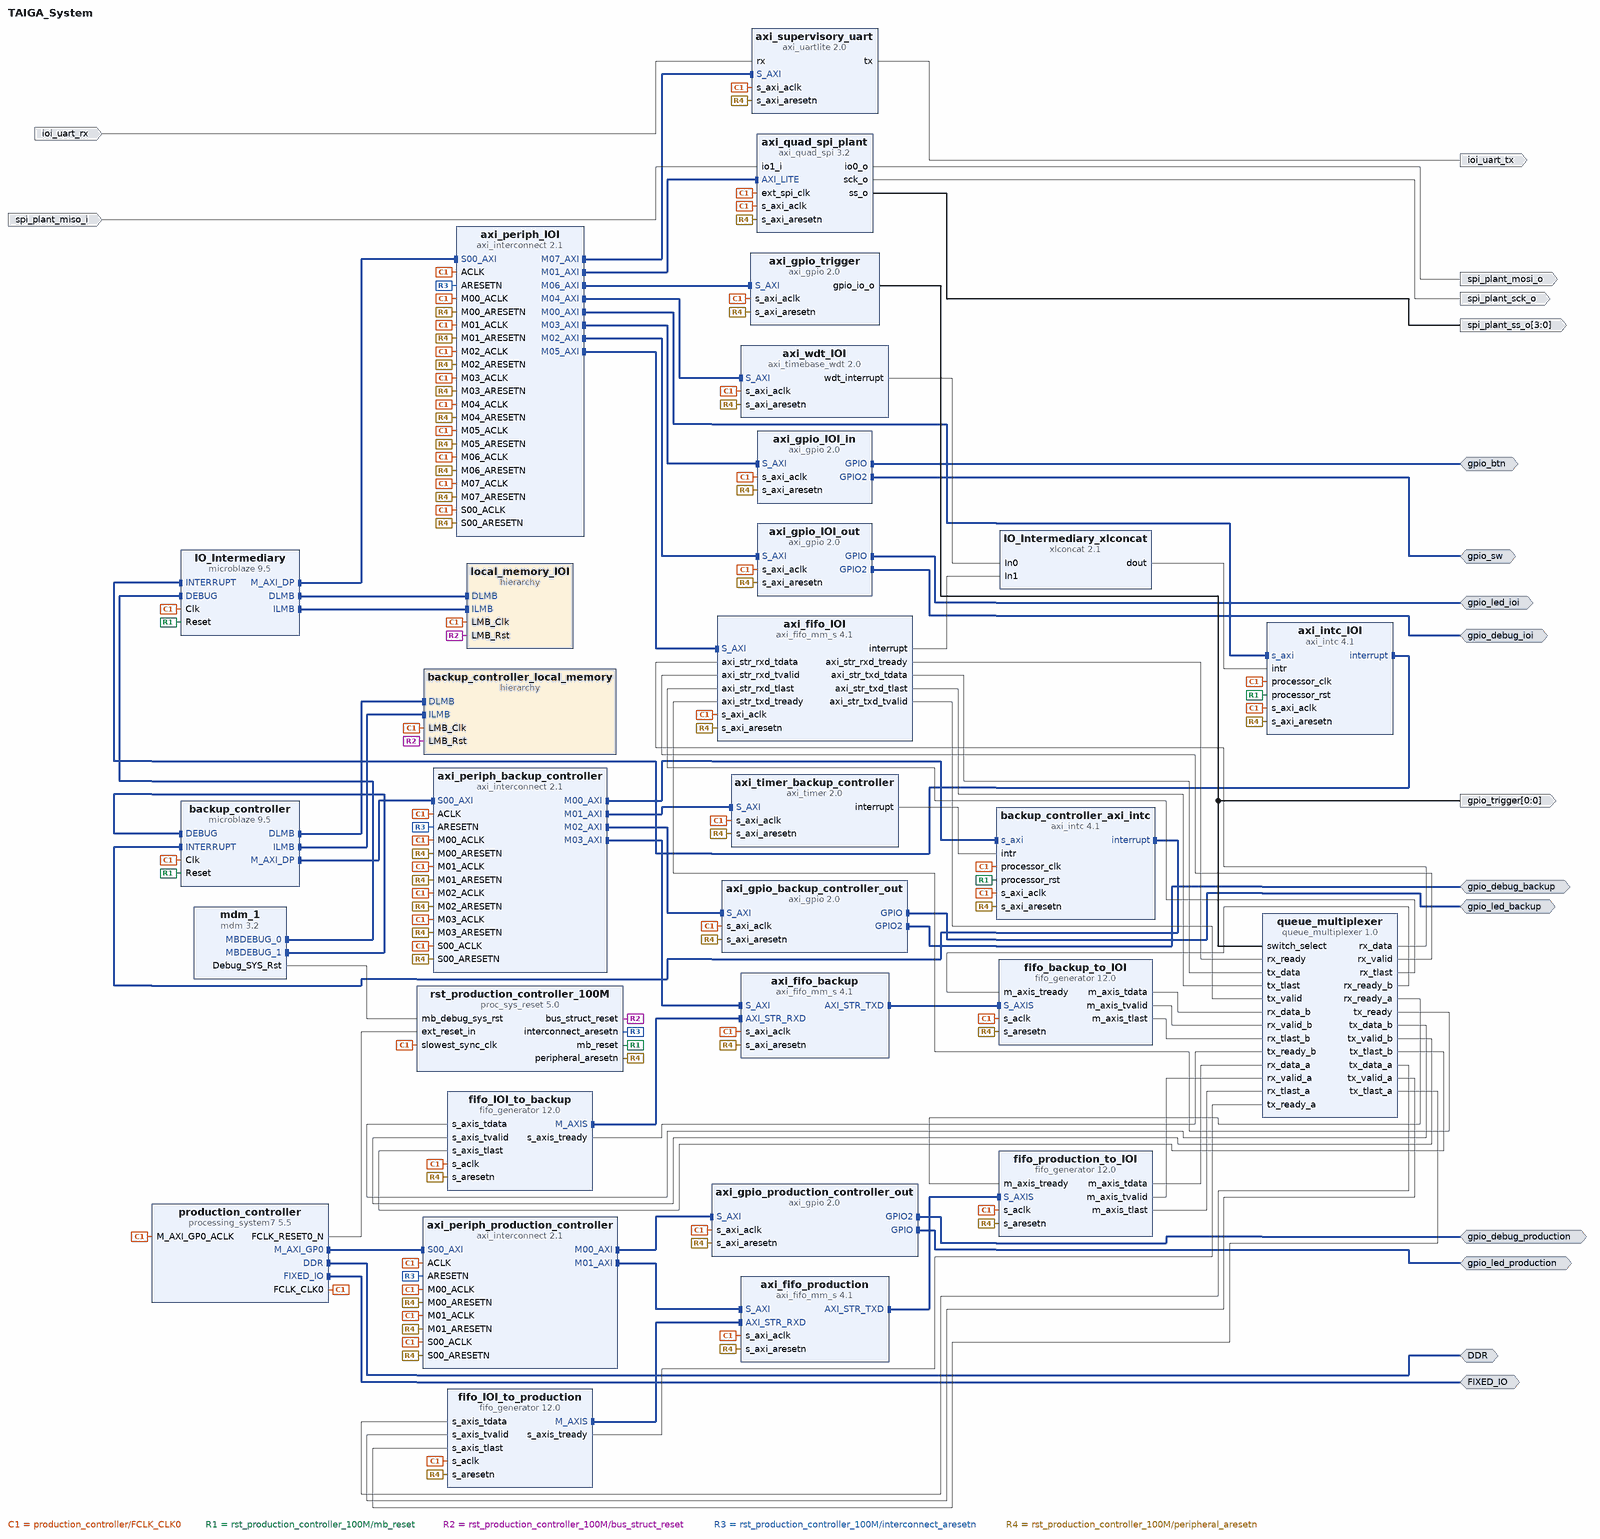
[diagram p0: block diagram of the top level]
# Vivado block design TAIGA_System, Vivado 2015.1
create_bd_design TAIGA_System

create_bd_intf_port -mode Master -vlnv xilinx.com:interface:ddrx_rtl:1.0 DDR
create_bd_intf_port -mode Master -vlnv xilinx.com:display_processing_system7:fixedio_rtl:1.0 FIXED_IO
create_bd_intf_port -mode Master -vlnv xilinx.com:interface:gpio_rtl:1.0 gpio_led_ioi
create_bd_intf_port -mode Master -vlnv xilinx.com:interface:gpio_rtl:1.0 gpio_btn
create_bd_intf_port -mode Master -vlnv xilinx.com:interface:gpio_rtl:1.0 gpio_sw
create_bd_intf_port -mode Master -vlnv xilinx.com:interface:gpio_rtl:1.0 gpio_led_backup
create_bd_intf_port -mode Master -vlnv xilinx.com:interface:gpio_rtl:1.0 gpio_led_production
create_bd_intf_port -mode Master -vlnv xilinx.com:interface:gpio_rtl:1.0 gpio_debug_ioi
create_bd_intf_port -mode Master -vlnv xilinx.com:interface:gpio_rtl:1.0 gpio_debug_production
create_bd_intf_port -mode Master -vlnv xilinx.com:interface:gpio_rtl:1.0 gpio_debug_backup
create_bd_port -dir O spi_plant_mosi_o
create_bd_port -dir I spi_plant_miso_i
create_bd_port -dir O spi_plant_sck_o
create_bd_port -dir O -from 3 -to 0 spi_plant_ss_o
create_bd_port -dir O -from 0 -to 0 gpio_trigger
create_bd_port -dir I ioi_uart_rx
create_bd_port -dir O ioi_uart_tx

create_bd_cell -type hier local_memory_IOI
create_bd_cell -type ip -vlnv xilinx.com:ip:xlconcat:2.1 IO_Intermediary_xlconcat
create_bd_cell -type hier backup_controller_local_memory
create_bd_cell -type ip -vlnv xilinx.com:hls:queue_multiplexer:1.0 queue_multiplexer
create_bd_cell -type ip -vlnv xilinx.com:ip:axi_intc:4.1 axi_intc_IOI
set_property -dict {CONFIG.C_HAS_FAST 1} [get_bd_cells axi_intc_IOI]
create_bd_cell -type ip -vlnv xilinx.com:ip:axi_interconnect:2.1 axi_periph_IOI
set_property -dict {CONFIG.NUM_MI 8} [get_bd_cells axi_periph_IOI]
create_bd_cell -type ip -vlnv xilinx.com:ip:axi_fifo_mm_s:4.1 axi_fifo_production
set_property -dict {CONFIG.C_DATA_INTERFACE_TYPE 0 CONFIG.C_USE_TX_DATA 1} [get_bd_cells axi_fifo_production]
create_bd_cell -type ip -vlnv xilinx.com:ip:axi_fifo_mm_s:4.1 axi_fifo_backup
set_property -dict {CONFIG.C_DATA_INTERFACE_TYPE 0 CONFIG.C_USE_TX_DATA 1} [get_bd_cells axi_fifo_backup]
create_bd_cell -type ip -vlnv xilinx.com:ip:axi_fifo_mm_s:4.1 axi_fifo_IOI
set_property -dict {CONFIG.C_DATA_INTERFACE_TYPE 0 CONFIG.C_USE_TX_DATA 1} [get_bd_cells axi_fifo_IOI]
create_bd_cell -type ip -vlnv xilinx.com:ip:axi_gpio:2.0 axi_gpio_IOI_out
set_property -dict [list \
  CONFIG.C_GPIO_WIDTH 1 \
  CONFIG.C_GPIO2_WIDTH 4 \
  CONFIG.C_IS_DUAL 1 \
  CONFIG.C_ALL_OUTPUTS 1 \
  CONFIG.C_ALL_OUTPUTS_2 1 \
] [get_bd_cells axi_gpio_IOI_out]
create_bd_cell -type ip -vlnv xilinx.com:ip:axi_gpio:2.0 axi_gpio_IOI_in
set_property -dict [list \
  CONFIG.C_GPIO_WIDTH 4 \
  CONFIG.C_GPIO2_WIDTH 4 \
  CONFIG.C_IS_DUAL 1 \
  CONFIG.C_ALL_INPUTS 1 \
  CONFIG.C_ALL_INPUTS_2 1 \
] [get_bd_cells axi_gpio_IOI_in]
create_bd_cell -type ip -vlnv xilinx.com:ip:axi_gpio:2.0 axi_gpio_backup_controller_out
set_property -dict [list \
  CONFIG.C_GPIO_WIDTH 1 \
  CONFIG.C_GPIO2_WIDTH 2 \
  CONFIG.C_IS_DUAL 1 \
  CONFIG.C_ALL_INPUTS 0 \
  CONFIG.C_ALL_OUTPUTS 1 \
  CONFIG.C_ALL_OUTPUTS_2 1 \
] [get_bd_cells axi_gpio_backup_controller_out]
create_bd_cell -type ip -vlnv xilinx.com:ip:axi_gpio:2.0 axi_gpio_production_controller_out
set_property -dict [list \
  CONFIG.C_GPIO_WIDTH 1 \
  CONFIG.C_GPIO2_WIDTH 2 \
  CONFIG.C_IS_DUAL 1 \
  CONFIG.C_ALL_OUTPUTS 1 \
  CONFIG.C_ALL_OUTPUTS_2 1 \
] [get_bd_cells axi_gpio_production_controller_out]
create_bd_cell -type ip -vlnv xilinx.com:ip:axi_gpio:2.0 axi_gpio_trigger
set_property -dict {CONFIG.C_GPIO_WIDTH 1 CONFIG.C_ALL_OUTPUTS 1} [get_bd_cells axi_gpio_trigger]
create_bd_cell -type ip -vlnv xilinx.com:ip:axi_interconnect:2.1 axi_periph_production_controller
set_property -dict {CONFIG.NUM_MI 2} [get_bd_cells axi_periph_production_controller]
create_bd_cell -type ip -vlnv xilinx.com:ip:axi_quad_spi:3.2 axi_quad_spi_plant
set_property -dict [list \
  CONFIG.C_USE_STARTUP 0 \
  CONFIG.C_NUM_SS_BITS 4 \
  CONFIG.C_FIFO_DEPTH 0 \
  CONFIG.FIFO_INCLUDED 0 \
  CONFIG.Multiples16 5 \
] [get_bd_cells axi_quad_spi_plant]
create_bd_cell -type ip -vlnv xilinx.com:ip:axi_timebase_wdt:2.0 axi_wdt_IOI
set_property -dict {CONFIG.C_WDT_INTERVAL 18 CONFIG.WDT_ENABLE_ONCE Enable_repeatedly} [get_bd_cells axi_wdt_IOI]
create_bd_cell -type ip -vlnv xilinx.com:ip:axi_timer:2.0 axi_timer_backup_controller
set_property -dict {CONFIG.enable_timer2 0} [get_bd_cells axi_timer_backup_controller]
create_bd_cell -type ip -vlnv xilinx.com:ip:axi_uartlite:2.0 axi_supervisory_uart
set_property -dict {CONFIG.C_BAUDRATE 921600} [get_bd_cells axi_supervisory_uart]
create_bd_cell -type ip -vlnv xilinx.com:ip:axi_intc:4.1 backup_controller_axi_intc
set_property -dict {CONFIG.C_HAS_FAST 1} [get_bd_cells backup_controller_axi_intc]
create_bd_cell -type ip -vlnv xilinx.com:ip:axi_interconnect:2.1 axi_periph_backup_controller
set_property -dict {CONFIG.NUM_MI 4} [get_bd_cells axi_periph_backup_controller]
create_bd_cell -type ip -vlnv xilinx.com:ip:fifo_generator:12.0 fifo_IOI_to_backup
set_property -dict [list \
  CONFIG.INTERFACE_TYPE AXI_STREAM \
  CONFIG.TDATA_NUM_BYTES 4 \
  CONFIG.Enable_TLAST true \
  CONFIG.HAS_TKEEP false \
  CONFIG.FIFO_Implementation_wach Common_Clock_Distributed_RAM \
  CONFIG.FIFO_Implementation_wrch Common_Clock_Distributed_RAM \
  CONFIG.FIFO_Implementation_rach Common_Clock_Distributed_RAM \
  CONFIG.Input_Depth_axis 1024 \
] [get_bd_cells fifo_IOI_to_backup]
create_bd_cell -type ip -vlnv xilinx.com:ip:fifo_generator:12.0 fifo_production_to_IOI
set_property -dict [list \
  CONFIG.INTERFACE_TYPE AXI_STREAM \
  CONFIG.TDATA_NUM_BYTES 4 \
  CONFIG.Enable_TLAST true \
  CONFIG.HAS_TKEEP false \
  CONFIG.FIFO_Implementation_wach Common_Clock_Distributed_RAM \
  CONFIG.FIFO_Implementation_wrch Common_Clock_Distributed_RAM \
  CONFIG.FIFO_Implementation_rach Common_Clock_Distributed_RAM \
  CONFIG.Input_Depth_axis 1024 \
] [get_bd_cells fifo_production_to_IOI]
create_bd_cell -type ip -vlnv xilinx.com:ip:fifo_generator:12.0 fifo_IOI_to_production
set_property -dict [list \
  CONFIG.INTERFACE_TYPE AXI_STREAM \
  CONFIG.TDATA_NUM_BYTES 4 \
  CONFIG.Enable_TLAST true \
  CONFIG.HAS_TKEEP false \
  CONFIG.FIFO_Implementation_wach Common_Clock_Distributed_RAM \
  CONFIG.FIFO_Implementation_wrch Common_Clock_Distributed_RAM \
  CONFIG.FIFO_Implementation_rach Common_Clock_Distributed_RAM \
  CONFIG.Input_Depth_axis 1024 \
] [get_bd_cells fifo_IOI_to_production]
create_bd_cell -type ip -vlnv xilinx.com:ip:fifo_generator:12.0 fifo_backup_to_IOI
set_property -dict [list \
  CONFIG.INTERFACE_TYPE AXI_STREAM \
  CONFIG.TDATA_NUM_BYTES 4 \
  CONFIG.Enable_TLAST true \
  CONFIG.HAS_TKEEP false \
  CONFIG.FIFO_Implementation_wach Common_Clock_Distributed_RAM \
  CONFIG.FIFO_Implementation_wrch Common_Clock_Distributed_RAM \
  CONFIG.FIFO_Implementation_rach Common_Clock_Distributed_RAM \
  CONFIG.Input_Depth_axis 1024 \
] [get_bd_cells fifo_backup_to_IOI]
create_bd_cell -type ip -vlnv xilinx.com:ip:mdm:3.2 mdm_1
set_property -dict {CONFIG.C_MB_DBG_PORTS 2} [get_bd_cells mdm_1]
create_bd_cell -type ip -vlnv xilinx.com:ip:microblaze:9.5 IO_Intermediary
set_property -dict [list \
  CONFIG.C_D_AXI 1 \
  CONFIG.C_D_LMB 1 \
  CONFIG.C_I_LMB 1 \
  CONFIG.C_USE_MSR_INSTR 1 \
  CONFIG.C_USE_PCMP_INSTR 1 \
  CONFIG.C_USE_BARREL 1 \
  CONFIG.C_USE_DIV 1 \
  CONFIG.C_USE_HW_MUL 1 \
  CONFIG.C_USE_FPU 2 \
  CONFIG.C_DEBUG_ENABLED 1 \
  CONFIG.C_USE_ICACHE 0 \
  CONFIG.C_USE_DCACHE 0 \
] [get_bd_cells IO_Intermediary]
create_bd_cell -type ip -vlnv xilinx.com:ip:microblaze:9.5 backup_controller
set_property -dict [list \
  CONFIG.C_D_AXI 1 \
  CONFIG.C_D_LMB 1 \
  CONFIG.C_I_LMB 1 \
  CONFIG.C_USE_MSR_INSTR 1 \
  CONFIG.C_USE_PCMP_INSTR 1 \
  CONFIG.C_USE_BARREL 1 \
  CONFIG.C_USE_DIV 1 \
  CONFIG.C_USE_HW_MUL 1 \
  CONFIG.C_USE_FPU 2 \
  CONFIG.C_DEBUG_ENABLED 1 \
  CONFIG.C_USE_ICACHE 0 \
  CONFIG.C_USE_DCACHE 0 \
] [get_bd_cells backup_controller]
create_bd_cell -type ip -vlnv xilinx.com:ip:processing_system7:5.5 production_controller
set_property -dict [list \
  CONFIG.PCW_FPGA0_PERIPHERAL_FREQMHZ 200.000000 \
  CONFIG.PCW_IMPORT_BOARD_PRESET /home/teja/Documents/TAIGA/ZYBO_zynq_def.xml \
  CONFIG.PCW_QSPI_GRP_SINGLE_SS_ENABLE 1 \
  CONFIG.PCW_UART1_UART1_IO {MIO 48 .. 49} \
] [get_bd_cells production_controller]
# 1 more settings of production_controller are not shown: defaults, MIO pin electricals, DDR timing, and values the tool derives
create_bd_cell -type ip -vlnv xilinx.com:ip:proc_sys_reset:5.0 rst_production_controller_100M

# ---- hierarchy /local_memory_IOI ----
current_bd_instance /local_memory_IOI
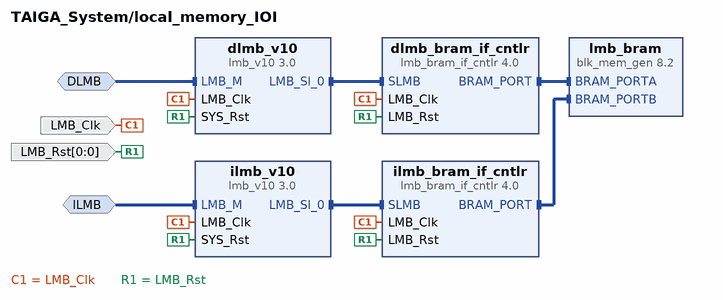
[diagram p1: block diagram inside /local_memory_IOI]
create_bd_intf_pin -mode MirroredMaster -vlnv xilinx.com:interface:lmb_rtl:1.0 DLMB
create_bd_intf_pin -mode MirroredMaster -vlnv xilinx.com:interface:lmb_rtl:1.0 ILMB
create_bd_pin -dir I -type clk LMB_Clk
create_bd_pin -dir I -from 0 -to 0 -type rst LMB_Rst

create_bd_cell -type ip -vlnv xilinx.com:ip:lmb_bram_if_cntlr:4.0 dlmb_bram_if_cntlr
set_property -dict {CONFIG.C_ECC 0} [get_bd_cells dlmb_bram_if_cntlr]
create_bd_cell -type ip -vlnv xilinx.com:ip:lmb_v10:3.0 dlmb_v10
create_bd_cell -type ip -vlnv xilinx.com:ip:lmb_bram_if_cntlr:4.0 ilmb_bram_if_cntlr
set_property -dict {CONFIG.C_ECC 0} [get_bd_cells ilmb_bram_if_cntlr]
create_bd_cell -type ip -vlnv xilinx.com:ip:lmb_v10:3.0 ilmb_v10
create_bd_cell -type ip -vlnv xilinx.com:ip:blk_mem_gen:8.2 lmb_bram
set_property -dict {CONFIG.Memory_Type True_Dual_Port_RAM CONFIG.use_bram_block BRAM_Controller} [get_bd_cells lmb_bram]

# ---- hierarchy /backup_controller_local_memory ----
current_bd_instance /backup_controller_local_memory
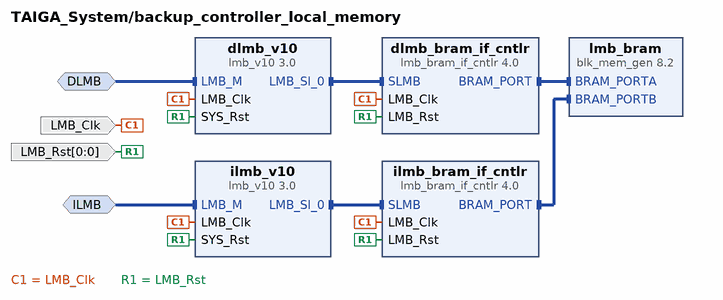
[diagram p2: block diagram inside /backup_controller_local_memory]
create_bd_intf_pin -mode MirroredMaster -vlnv xilinx.com:interface:lmb_rtl:1.0 DLMB
create_bd_intf_pin -mode MirroredMaster -vlnv xilinx.com:interface:lmb_rtl:1.0 ILMB
create_bd_pin -dir I -type clk LMB_Clk
create_bd_pin -dir I -from 0 -to 0 -type rst LMB_Rst

create_bd_cell -type ip -vlnv xilinx.com:ip:lmb_bram_if_cntlr:4.0 dlmb_bram_if_cntlr
set_property -dict {CONFIG.C_ECC 0} [get_bd_cells dlmb_bram_if_cntlr]
create_bd_cell -type ip -vlnv xilinx.com:ip:lmb_v10:3.0 dlmb_v10
create_bd_cell -type ip -vlnv xilinx.com:ip:lmb_bram_if_cntlr:4.0 ilmb_bram_if_cntlr
set_property -dict {CONFIG.C_ECC 0} [get_bd_cells ilmb_bram_if_cntlr]
create_bd_cell -type ip -vlnv xilinx.com:ip:lmb_v10:3.0 ilmb_v10
create_bd_cell -type ip -vlnv xilinx.com:ip:blk_mem_gen:8.2 lmb_bram
set_property -dict {CONFIG.Memory_Type True_Dual_Port_RAM CONFIG.use_bram_block BRAM_Controller} [get_bd_cells lmb_bram]

# ---- connections ----

current_bd_instance /local_memory_IOI
connect_bd_intf_net [get_bd_intf_pins dlmb_v10/LMB_Sl_0] [get_bd_intf_pins dlmb_bram_if_cntlr/SLMB]
connect_bd_intf_net [get_bd_intf_pins ilmb_v10/LMB_Sl_0] [get_bd_intf_pins ilmb_bram_if_cntlr/SLMB]
connect_bd_intf_net [get_bd_intf_pins dlmb_bram_if_cntlr/BRAM_PORT] [get_bd_intf_pins lmb_bram/BRAM_PORTA]
connect_bd_intf_net [get_bd_intf_pins ilmb_bram_if_cntlr/BRAM_PORT] [get_bd_intf_pins lmb_bram/BRAM_PORTB]
connect_bd_intf_net [get_bd_intf_pins DLMB] [get_bd_intf_pins dlmb_v10/LMB_M]
connect_bd_intf_net [get_bd_intf_pins ILMB] [get_bd_intf_pins ilmb_v10/LMB_M]
connect_bd_net -net IO_Intermediary_Clk [get_bd_pins LMB_Clk] \
  [get_bd_pins dlmb_bram_if_cntlr/LMB_Clk] [get_bd_pins dlmb_v10/LMB_Clk] [get_bd_pins ilmb_bram_if_cntlr/LMB_Clk] \
  [get_bd_pins ilmb_v10/LMB_Clk]
connect_bd_net -net IO_Intermediary_LMB_Rst [get_bd_pins LMB_Rst] \
  [get_bd_pins dlmb_bram_if_cntlr/LMB_Rst] [get_bd_pins dlmb_v10/SYS_Rst] [get_bd_pins ilmb_bram_if_cntlr/LMB_Rst] \
  [get_bd_pins ilmb_v10/SYS_Rst]

current_bd_instance /backup_controller_local_memory
connect_bd_intf_net [get_bd_intf_pins dlmb_v10/LMB_Sl_0] [get_bd_intf_pins dlmb_bram_if_cntlr/SLMB]
connect_bd_intf_net [get_bd_intf_pins ilmb_v10/LMB_Sl_0] [get_bd_intf_pins ilmb_bram_if_cntlr/SLMB]
connect_bd_intf_net [get_bd_intf_pins dlmb_bram_if_cntlr/BRAM_PORT] [get_bd_intf_pins lmb_bram/BRAM_PORTA]
connect_bd_intf_net [get_bd_intf_pins ilmb_bram_if_cntlr/BRAM_PORT] [get_bd_intf_pins lmb_bram/BRAM_PORTB]
connect_bd_intf_net [get_bd_intf_pins DLMB] [get_bd_intf_pins dlmb_v10/LMB_M]
connect_bd_intf_net [get_bd_intf_pins ILMB] [get_bd_intf_pins ilmb_v10/LMB_M]
connect_bd_net -net backup_controller_Clk [get_bd_pins LMB_Clk] \
  [get_bd_pins dlmb_bram_if_cntlr/LMB_Clk] [get_bd_pins dlmb_v10/LMB_Clk] [get_bd_pins ilmb_bram_if_cntlr/LMB_Clk] \
  [get_bd_pins ilmb_v10/LMB_Clk]
connect_bd_net -net backup_controller_LMB_Rst [get_bd_pins LMB_Rst] \
  [get_bd_pins dlmb_bram_if_cntlr/LMB_Rst] [get_bd_pins dlmb_v10/SYS_Rst] [get_bd_pins ilmb_bram_if_cntlr/LMB_Rst] \
  [get_bd_pins ilmb_v10/SYS_Rst]

current_bd_instance /
connect_bd_intf_net [get_bd_intf_pins IO_Intermediary/DLMB] [get_bd_intf_pins local_memory_IOI/DLMB]
connect_bd_intf_net [get_bd_intf_pins IO_Intermediary/ILMB] [get_bd_intf_pins local_memory_IOI/ILMB]
connect_bd_intf_net [get_bd_intf_pins axi_periph_IOI/S00_AXI] [get_bd_intf_pins IO_Intermediary/M_AXI_DP]
connect_bd_intf_net [get_bd_intf_pins axi_intc_IOI/interrupt] [get_bd_intf_pins IO_Intermediary/INTERRUPT]
connect_bd_intf_net [get_bd_intf_pins axi_periph_IOI/M00_AXI] [get_bd_intf_pins axi_intc_IOI/s_axi]
connect_bd_intf_net [get_bd_intf_pins mdm_1/MBDEBUG_0] [get_bd_intf_pins IO_Intermediary/DEBUG]
connect_bd_intf_net [get_bd_intf_pins axi_periph_IOI/M01_AXI] [get_bd_intf_pins axi_quad_spi_plant/AXI_LITE]
connect_bd_intf_net [get_bd_intf_pins axi_periph_IOI/M02_AXI] [get_bd_intf_pins axi_gpio_IOI_out/S_AXI]
connect_bd_intf_net [get_bd_intf_pins axi_periph_IOI/M03_AXI] [get_bd_intf_pins axi_gpio_IOI_in/S_AXI]
connect_bd_intf_net [get_bd_intf_pins axi_periph_IOI/M04_AXI] [get_bd_intf_pins axi_wdt_IOI/S_AXI]
connect_bd_intf_net [get_bd_intf_pins axi_fifo_production/AXI_STR_RXD] [get_bd_intf_pins fifo_IOI_to_production/M_AXIS]
connect_bd_intf_net [get_bd_intf_pins axi_fifo_backup/AXI_STR_RXD] [get_bd_intf_pins fifo_IOI_to_backup/M_AXIS]
connect_bd_intf_net [get_bd_intf_pins backup_controller/DLMB] [get_bd_intf_pins backup_controller_local_memory/DLMB]
connect_bd_intf_net [get_bd_intf_pins backup_controller/ILMB] [get_bd_intf_pins backup_controller_local_memory/ILMB]
connect_bd_intf_net [get_bd_intf_pins axi_periph_backup_controller/S00_AXI] [get_bd_intf_pins backup_controller/M_AXI_DP]
connect_bd_intf_net [get_bd_intf_pins backup_controller_axi_intc/interrupt] [get_bd_intf_pins backup_controller/INTERRUPT]
connect_bd_intf_net [get_bd_intf_pins axi_periph_backup_controller/M00_AXI] [get_bd_intf_pins backup_controller_axi_intc/s_axi]
connect_bd_intf_net [get_bd_intf_pins mdm_1/MBDEBUG_1] [get_bd_intf_pins backup_controller/DEBUG]
connect_bd_intf_net [get_bd_intf_pins axi_periph_backup_controller/M01_AXI] [get_bd_intf_pins axi_timer_backup_controller/S_AXI]
connect_bd_intf_net [get_bd_intf_pins axi_periph_backup_controller/M02_AXI] [get_bd_intf_pins axi_gpio_backup_controller_out/S_AXI]
connect_bd_intf_net [get_bd_intf_pins production_controller/M_AXI_GP0] [get_bd_intf_pins axi_periph_production_controller/S00_AXI]
connect_bd_intf_net [get_bd_intf_pins axi_periph_production_controller/M00_AXI] [get_bd_intf_pins axi_gpio_production_controller_out/S_AXI]
connect_bd_intf_net [get_bd_intf_pins axi_periph_production_controller/M01_AXI] [get_bd_intf_pins axi_fifo_production/S_AXI]
connect_bd_intf_net [get_bd_intf_pins axi_fifo_production/AXI_STR_TXD] [get_bd_intf_pins fifo_production_to_IOI/S_AXIS]
connect_bd_intf_net [get_bd_intf_pins axi_fifo_backup/AXI_STR_TXD] [get_bd_intf_pins fifo_backup_to_IOI/S_AXIS]
connect_bd_intf_net [get_bd_intf_pins axi_periph_backup_controller/M03_AXI] [get_bd_intf_pins axi_fifo_backup/S_AXI]
connect_bd_intf_net [get_bd_intf_pins axi_periph_IOI/M06_AXI] [get_bd_intf_pins axi_gpio_trigger/S_AXI]
connect_bd_intf_net [get_bd_intf_pins axi_periph_IOI/M07_AXI] [get_bd_intf_pins axi_supervisory_uart/S_AXI]
connect_bd_intf_net [get_bd_intf_pins axi_periph_IOI/M05_AXI] [get_bd_intf_pins axi_fifo_IOI/S_AXI]
connect_bd_intf_net [get_bd_intf_ports DDR] [get_bd_intf_pins production_controller/DDR]
connect_bd_intf_net [get_bd_intf_ports FIXED_IO] [get_bd_intf_pins production_controller/FIXED_IO]
connect_bd_intf_net [get_bd_intf_ports gpio_led_ioi] [get_bd_intf_pins axi_gpio_IOI_out/GPIO]
connect_bd_intf_net [get_bd_intf_ports gpio_btn] [get_bd_intf_pins axi_gpio_IOI_in/GPIO]
connect_bd_intf_net [get_bd_intf_ports gpio_sw] [get_bd_intf_pins axi_gpio_IOI_in/GPIO2]
connect_bd_intf_net [get_bd_intf_ports gpio_led_backup] [get_bd_intf_pins axi_gpio_backup_controller_out/GPIO]
connect_bd_intf_net [get_bd_intf_ports gpio_led_production] [get_bd_intf_pins axi_gpio_production_controller_out/GPIO]
connect_bd_intf_net [get_bd_intf_ports gpio_debug_ioi] [get_bd_intf_pins axi_gpio_IOI_out/GPIO2]
connect_bd_intf_net [get_bd_intf_ports gpio_debug_production] [get_bd_intf_pins axi_gpio_production_controller_out/GPIO2]
connect_bd_intf_net [get_bd_intf_ports gpio_debug_backup] [get_bd_intf_pins axi_gpio_backup_controller_out/GPIO2]
connect_bd_net -net backup_controller_Clk [get_bd_pins production_controller/FCLK_CLK0] \
  [get_bd_pins axi_intc_IOI/s_axi_aclk] [get_bd_pins axi_intc_IOI/processor_clk] [get_bd_pins axi_fifo_production/s_axi_aclk] \
  [get_bd_pins axi_fifo_backup/s_axi_aclk] [get_bd_pins axi_fifo_IOI/s_axi_aclk] [get_bd_pins axi_gpio_IOI_out/s_axi_aclk] \
  [get_bd_pins axi_gpio_IOI_in/s_axi_aclk] [get_bd_pins axi_gpio_backup_controller_out/s_axi_aclk] \
  [get_bd_pins axi_gpio_production_controller_out/s_axi_aclk] [get_bd_pins axi_gpio_trigger/s_axi_aclk] \
  [get_bd_pins axi_quad_spi_plant/ext_spi_clk] [get_bd_pins axi_quad_spi_plant/s_axi_aclk] \
  [get_bd_pins axi_wdt_IOI/s_axi_aclk] [get_bd_pins axi_timer_backup_controller/s_axi_aclk] \
  [get_bd_pins axi_supervisory_uart/s_axi_aclk] [get_bd_pins backup_controller_axi_intc/s_axi_aclk] \
  [get_bd_pins backup_controller_axi_intc/processor_clk] [get_bd_pins fifo_IOI_to_backup/s_aclk] \
  [get_bd_pins fifo_production_to_IOI/s_aclk] [get_bd_pins fifo_IOI_to_production/s_aclk] \
  [get_bd_pins fifo_backup_to_IOI/s_aclk] [get_bd_pins IO_Intermediary/Clk] [get_bd_pins backup_controller/Clk] \
  [get_bd_pins production_controller/M_AXI_GP0_ACLK] [get_bd_pins rst_production_controller_100M/slowest_sync_clk] \
  [get_bd_pins local_memory_IOI/LMB_Clk] [get_bd_pins backup_controller_local_memory/LMB_Clk] \
  [get_bd_pins axi_periph_IOI/ACLK] [get_bd_pins axi_periph_IOI/S00_ACLK] [get_bd_pins axi_periph_IOI/M00_ACLK] \
  [get_bd_pins axi_periph_IOI/M01_ACLK] [get_bd_pins axi_periph_IOI/M02_ACLK] [get_bd_pins axi_periph_IOI/M03_ACLK] \
  [get_bd_pins axi_periph_IOI/M04_ACLK] [get_bd_pins axi_periph_IOI/M05_ACLK] [get_bd_pins axi_periph_IOI/M06_ACLK] \
  [get_bd_pins axi_periph_IOI/M07_ACLK] [get_bd_pins axi_periph_production_controller/ACLK] \
  [get_bd_pins axi_periph_production_controller/S00_ACLK] [get_bd_pins axi_periph_production_controller/M00_ACLK] \
  [get_bd_pins axi_periph_production_controller/M01_ACLK] [get_bd_pins axi_periph_backup_controller/ACLK] \
  [get_bd_pins axi_periph_backup_controller/S00_ACLK] [get_bd_pins axi_periph_backup_controller/M00_ACLK] \
  [get_bd_pins axi_periph_backup_controller/M01_ACLK] [get_bd_pins axi_periph_backup_controller/M02_ACLK] \
  [get_bd_pins axi_periph_backup_controller/M03_ACLK]
connect_bd_net -net IO_Intermediary_intr [get_bd_pins IO_Intermediary_xlconcat/dout] [get_bd_pins axi_intc_IOI/intr]
connect_bd_net [get_bd_pins production_controller/FCLK_RESET0_N] [get_bd_pins rst_production_controller_100M/ext_reset_in]
connect_bd_net [get_bd_pins rst_production_controller_100M/mb_reset] \
  [get_bd_pins axi_intc_IOI/processor_rst] [get_bd_pins backup_controller_axi_intc/processor_rst] \
  [get_bd_pins IO_Intermediary/Reset] [get_bd_pins backup_controller/Reset]
connect_bd_net [get_bd_pins rst_production_controller_100M/bus_struct_reset] \
  [get_bd_pins local_memory_IOI/LMB_Rst] [get_bd_pins backup_controller_local_memory/LMB_Rst]
connect_bd_net [get_bd_pins rst_production_controller_100M/interconnect_aresetn] \
  [get_bd_pins axi_periph_IOI/ARESETN] [get_bd_pins axi_periph_production_controller/ARESETN] \
  [get_bd_pins axi_periph_backup_controller/ARESETN]
connect_bd_net [get_bd_pins rst_production_controller_100M/peripheral_aresetn] \
  [get_bd_pins axi_intc_IOI/s_axi_aresetn] [get_bd_pins axi_fifo_production/s_axi_aresetn] \
  [get_bd_pins axi_fifo_backup/s_axi_aresetn] [get_bd_pins axi_fifo_IOI/s_axi_aresetn] \
  [get_bd_pins axi_gpio_IOI_out/s_axi_aresetn] [get_bd_pins axi_gpio_IOI_in/s_axi_aresetn] \
  [get_bd_pins axi_gpio_backup_controller_out/s_axi_aresetn] [get_bd_pins axi_gpio_production_controller_out/s_axi_aresetn] \
  [get_bd_pins axi_gpio_trigger/s_axi_aresetn] [get_bd_pins axi_quad_spi_plant/s_axi_aresetn] \
  [get_bd_pins axi_wdt_IOI/s_axi_aresetn] [get_bd_pins axi_timer_backup_controller/s_axi_aresetn] \
  [get_bd_pins axi_supervisory_uart/s_axi_aresetn] [get_bd_pins backup_controller_axi_intc/s_axi_aresetn] \
  [get_bd_pins fifo_IOI_to_backup/s_aresetn] [get_bd_pins fifo_production_to_IOI/s_aresetn] \
  [get_bd_pins fifo_IOI_to_production/s_aresetn] [get_bd_pins fifo_backup_to_IOI/s_aresetn] \
  [get_bd_pins axi_periph_IOI/S00_ARESETN] [get_bd_pins axi_periph_IOI/M00_ARESETN] [get_bd_pins axi_periph_IOI/M01_ARESETN] \
  [get_bd_pins axi_periph_IOI/M02_ARESETN] [get_bd_pins axi_periph_IOI/M03_ARESETN] [get_bd_pins axi_periph_IOI/M04_ARESETN] \
  [get_bd_pins axi_periph_IOI/M05_ARESETN] [get_bd_pins axi_periph_IOI/M06_ARESETN] [get_bd_pins axi_periph_IOI/M07_ARESETN] \
  [get_bd_pins axi_periph_production_controller/S00_ARESETN] [get_bd_pins axi_periph_production_controller/M00_ARESETN] \
  [get_bd_pins axi_periph_production_controller/M01_ARESETN] [get_bd_pins axi_periph_backup_controller/S00_ARESETN] \
  [get_bd_pins axi_periph_backup_controller/M00_ARESETN] [get_bd_pins axi_periph_backup_controller/M01_ARESETN] \
  [get_bd_pins axi_periph_backup_controller/M02_ARESETN] [get_bd_pins axi_periph_backup_controller/M03_ARESETN]
connect_bd_net [get_bd_pins mdm_1/Debug_SYS_Rst] [get_bd_pins rst_production_controller_100M/mb_debug_sys_rst]
connect_bd_net [get_bd_pins axi_quad_spi_plant/io0_o] [get_bd_ports spi_plant_mosi_o]
connect_bd_net -net io1_i_1 [get_bd_ports spi_plant_miso_i] [get_bd_pins axi_quad_spi_plant/io1_i]
connect_bd_net [get_bd_pins axi_quad_spi_plant/sck_o] [get_bd_ports spi_plant_sck_o]
connect_bd_net [get_bd_pins axi_quad_spi_plant/ss_o] [get_bd_ports spi_plant_ss_o]
connect_bd_net [get_bd_pins axi_wdt_IOI/wdt_interrupt] [get_bd_pins IO_Intermediary_xlconcat/In0]
connect_bd_net -net queue_multiplexer_0_rx_data [get_bd_pins queue_multiplexer/rx_data] [get_bd_pins axi_fifo_IOI/axi_str_rxd_tdata]
connect_bd_net -net queue_multiplexer_0_rx_valid [get_bd_pins queue_multiplexer/rx_valid] [get_bd_pins axi_fifo_IOI/axi_str_rxd_tvalid]
connect_bd_net -net axi_fifo_IOI_dequeue_axi_str_rxd_tready [get_bd_pins axi_fifo_IOI/axi_str_rxd_tready] [get_bd_pins queue_multiplexer/rx_ready]
connect_bd_net -net queue_multiplexer_0_tx_data_a [get_bd_pins queue_multiplexer/tx_data_a] [get_bd_pins fifo_IOI_to_production/s_axis_tdata]
connect_bd_net -net queue_multiplexer_0_tx_valid_a [get_bd_pins queue_multiplexer/tx_valid_a] [get_bd_pins fifo_IOI_to_production/s_axis_tvalid]
connect_bd_net [get_bd_pins fifo_IOI_to_production/s_axis_tready] [get_bd_pins queue_multiplexer/tx_ready_a]
connect_bd_net [get_bd_pins fifo_production_to_IOI/m_axis_tdata] [get_bd_pins queue_multiplexer/rx_data_a]
connect_bd_net -net queue_multiplexer_0_rx_ready_a [get_bd_pins queue_multiplexer/rx_ready_a] [get_bd_pins fifo_production_to_IOI/m_axis_tready]
connect_bd_net [get_bd_pins fifo_production_to_IOI/m_axis_tvalid] [get_bd_pins queue_multiplexer/rx_valid_a]
connect_bd_net -net queue_multiplexer_0_tx_data_b [get_bd_pins queue_multiplexer/tx_data_b] [get_bd_pins fifo_IOI_to_backup/s_axis_tdata]
connect_bd_net [get_bd_pins fifo_IOI_to_backup/s_axis_tready] [get_bd_pins queue_multiplexer/tx_ready_b]
connect_bd_net -net queue_multiplexer_0_tx_valid_b [get_bd_pins queue_multiplexer/tx_valid_b] [get_bd_pins fifo_IOI_to_backup/s_axis_tvalid]
connect_bd_net [get_bd_pins fifo_backup_to_IOI/m_axis_tdata] [get_bd_pins queue_multiplexer/rx_data_b]
connect_bd_net [get_bd_pins fifo_backup_to_IOI/m_axis_tvalid] [get_bd_pins queue_multiplexer/rx_valid_b]
connect_bd_net -net queue_multiplexer_0_rx_ready_b [get_bd_pins queue_multiplexer/rx_ready_b] [get_bd_pins fifo_backup_to_IOI/m_axis_tready]
connect_bd_net -net axi_fifo_IOI_dequeue_interrupt [get_bd_pins axi_fifo_IOI/interrupt] [get_bd_pins IO_Intermediary_xlconcat/In1]
connect_bd_net [get_bd_pins axi_timer_backup_controller/interrupt] [get_bd_pins backup_controller_axi_intc/intr]
connect_bd_net [get_bd_pins axi_gpio_trigger/gpio_io_o] [get_bd_ports gpio_trigger] [get_bd_pins queue_multiplexer/switch_select]
connect_bd_net -net rx_1 [get_bd_ports ioi_uart_rx] [get_bd_pins axi_supervisory_uart/rx]
connect_bd_net [get_bd_pins axi_supervisory_uart/tx] [get_bd_ports ioi_uart_tx]
connect_bd_net [get_bd_pins fifo_production_to_IOI/m_axis_tlast] [get_bd_pins queue_multiplexer/rx_tlast_a]
connect_bd_net [get_bd_pins fifo_backup_to_IOI/m_axis_tlast] [get_bd_pins queue_multiplexer/rx_tlast_b]
connect_bd_net [get_bd_pins queue_multiplexer/rx_tlast] [get_bd_pins axi_fifo_IOI/axi_str_rxd_tlast]
connect_bd_net [get_bd_pins queue_multiplexer/tx_tlast_a] [get_bd_pins fifo_IOI_to_production/s_axis_tlast]
connect_bd_net [get_bd_pins queue_multiplexer/tx_tlast_b] [get_bd_pins fifo_IOI_to_backup/s_axis_tlast]
connect_bd_net -net axi_fifo_IOI_dequeue_axi_str_txd_tdata [get_bd_pins axi_fifo_IOI/axi_str_txd_tdata] [get_bd_pins queue_multiplexer/tx_data]
connect_bd_net -net axi_fifo_IOI_dequeue_axi_str_txd_tlast [get_bd_pins axi_fifo_IOI/axi_str_txd_tlast] [get_bd_pins queue_multiplexer/tx_tlast]
connect_bd_net -net axi_fifo_IOI_dequeue_axi_str_txd_tvalid [get_bd_pins axi_fifo_IOI/axi_str_txd_tvalid] [get_bd_pins queue_multiplexer/tx_valid]
connect_bd_net [get_bd_pins queue_multiplexer/tx_ready] [get_bd_pins axi_fifo_IOI/axi_str_txd_tready]

# ---- address map ----
assign_bd_address -offset 0x00000000 -range 32K -target_address_space [get_bd_addr_spaces backup_controller/Data] [get_bd_addr_segs backup_controller_local_memory/dlmb_bram_if_cntlr/SLMB/Mem]
assign_bd_address -offset 0x40000000 -range 64K -target_address_space [get_bd_addr_spaces backup_controller/Data] [get_bd_addr_segs axi_gpio_backup_controller_out/S_AXI/Reg]
assign_bd_address -offset 0x41200000 -range 64K -target_address_space [get_bd_addr_spaces backup_controller/Data] [get_bd_addr_segs backup_controller_axi_intc/s_axi/Reg]
assign_bd_address -offset 0x41C00000 -range 64K -target_address_space [get_bd_addr_spaces backup_controller/Data] [get_bd_addr_segs axi_timer_backup_controller/S_AXI/Reg]
assign_bd_address -offset 0x44A00000 -range 64K -target_address_space [get_bd_addr_spaces backup_controller/Data] [get_bd_addr_segs axi_fifo_backup/S_AXI/Mem0]
assign_bd_address -offset 0x00000000 -range 32K -target_address_space [get_bd_addr_spaces backup_controller/Instruction] [get_bd_addr_segs backup_controller_local_memory/ilmb_bram_if_cntlr/SLMB/Mem]
assign_bd_address -offset 0x00000000 -range 128K -target_address_space [get_bd_addr_spaces IO_Intermediary/Data] [get_bd_addr_segs local_memory_IOI/dlmb_bram_if_cntlr/SLMB/Mem]
assign_bd_address -offset 0x40000000 -range 64K -target_address_space [get_bd_addr_spaces IO_Intermediary/Data] [get_bd_addr_segs axi_gpio_IOI_out/S_AXI/Reg]
assign_bd_address -offset 0x40010000 -range 64K -target_address_space [get_bd_addr_spaces IO_Intermediary/Data] [get_bd_addr_segs axi_gpio_IOI_in/S_AXI/Reg]
assign_bd_address -offset 0x40020000 -range 64K -target_address_space [get_bd_addr_spaces IO_Intermediary/Data] [get_bd_addr_segs axi_gpio_trigger/S_AXI/Reg]
assign_bd_address -offset 0x40600000 -range 64K -target_address_space [get_bd_addr_spaces IO_Intermediary/Data] [get_bd_addr_segs axi_supervisory_uart/S_AXI/Reg]
assign_bd_address -offset 0x41200000 -range 64K -target_address_space [get_bd_addr_spaces IO_Intermediary/Data] [get_bd_addr_segs axi_intc_IOI/s_axi/Reg]
assign_bd_address -offset 0x41A00000 -range 64K -target_address_space [get_bd_addr_spaces IO_Intermediary/Data] [get_bd_addr_segs axi_wdt_IOI/S_AXI/Reg]
assign_bd_address -offset 0x44A00000 -range 64K -target_address_space [get_bd_addr_spaces IO_Intermediary/Data] [get_bd_addr_segs axi_quad_spi_plant/AXI_LITE/Reg]
assign_bd_address -offset 0x44A10000 -range 64K -target_address_space [get_bd_addr_spaces IO_Intermediary/Data] [get_bd_addr_segs axi_fifo_IOI/S_AXI/Mem0]
assign_bd_address -offset 0x00000000 -range 128K -target_address_space [get_bd_addr_spaces IO_Intermediary/Instruction] [get_bd_addr_segs local_memory_IOI/ilmb_bram_if_cntlr/SLMB/Mem]
assign_bd_address -offset 0x41200000 -range 64K -target_address_space [get_bd_addr_spaces production_controller/Data] [get_bd_addr_segs axi_gpio_production_controller_out/S_AXI/Reg]
assign_bd_address -offset 0x43C00000 -range 64K -target_address_space [get_bd_addr_spaces production_controller/Data] [get_bd_addr_segs axi_fifo_production/S_AXI/Mem0]

validate_bd_design
save_bd_design
